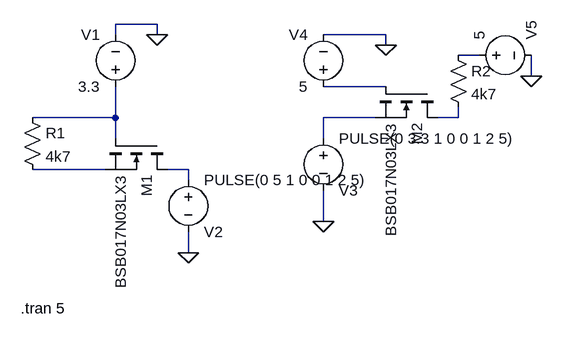
[diagram p0: schematic konw.asc]
konw.asc, the LTspice schematic file:
Version 4
SHEET 1 880 680
WIRE 208 -48 144 -48
WIRE 144 -32 144 -48
WIRE 208 -32 208 -48
WIRE 560 -32 464 -32
WIRE 560 -16 560 -32
WIRE 704 0 672 0
WIRE 784 32 784 0
WIRE 560 48 464 48
WIRE 144 96 144 48
WIRE 144 96 16 96
WIRE 544 96 464 96
WIRE 672 96 672 80
WIRE 672 96 640 96
WIRE 144 128 144 96
WIRE 464 128 464 96
WIRE 128 176 16 176
WIRE 256 176 224 176
WIRE 256 192 256 176
WIRE 464 256 464 208
WIRE 256 304 256 272
FLAG 208 -32 0
FLAG 256 304 0
FLAG 464 256 0
FLAG 560 -16 0
FLAG 784 32 0
SYMBOL nmos 224 128 R90
SYMATTR InstName M1
SYMATTR Value BSB017N03LX3
SYMBOL res 0 80 R0
SYMATTR InstName R1
SYMATTR Value 4k7
SYMBOL voltage 144 64 R180
WINDOW 0 24 96 Left 2
WINDOW 3 24 16 Left 2
WINDOW 123 0 0 Left 2
WINDOW 39 0 0 Left 2
SYMATTR InstName V1
SYMATTR Value 3.3
SYMBOL voltage 256 176 R0
WINDOW 0 24 96 Left 2
WINDOW 3 24 16 Left 2
WINDOW 123 0 0 Left 2
WINDOW 39 0 0 Left 2
SYMATTR InstName V2
SYMATTR Value PULSE(0 5 1 0 0 1 2 5)
SYMBOL nmos 640 48 R90
SYMATTR InstName M2
SYMATTR Value BSB017N03LX3
SYMBOL voltage 464 112 R0
WINDOW 0 24 96 Left 2
WINDOW 3 24 16 Left 2
WINDOW 123 0 0 Left 2
WINDOW 39 0 0 Left 2
SYMATTR InstName V3
SYMATTR Value PULSE(0 3.3 1 0 0 1 2 5)
SYMBOL voltage 464 64 R180
WINDOW 0 24 96 Left 2
WINDOW 3 24 16 Left 2
WINDOW 123 0 0 Left 2
WINDOW 39 0 0 Left 2
SYMATTR InstName V4
SYMATTR Value 5
SYMBOL res 656 -16 R0
SYMATTR InstName R2
SYMATTR Value 4k7
SYMBOL voltage 688 0 R270
WINDOW 0 24 96 Left 2
WINDOW 3 24 16 Left 2
WINDOW 123 0 0 Left 2
WINDOW 39 0 0 Left 2
SYMATTR InstName V5
SYMATTR Value 5
TEXT -2 390 Left 2 !.tran 5

The netlist it stands for:
* konw.asc
M1 N007 N003 N006 N006 BSB017N03LX3
R1 N003 N006 4k7
V1 N003 0 3.3
V2 N007 0 PULSE(0 5 1 0 0 1 2 5)
M2 N005 N002 N004 N004 BSB017N03LX3
V3 N004 0 PULSE(0 3.3 1 0 0 1 2 5)
V4 N002 0 5
R2 N001 N005 4k7
V5 N001 0 5
.model NMOS NMOS
.model PMOS PMOS
.lib standard.mos
.tran 5
.backanno
.end